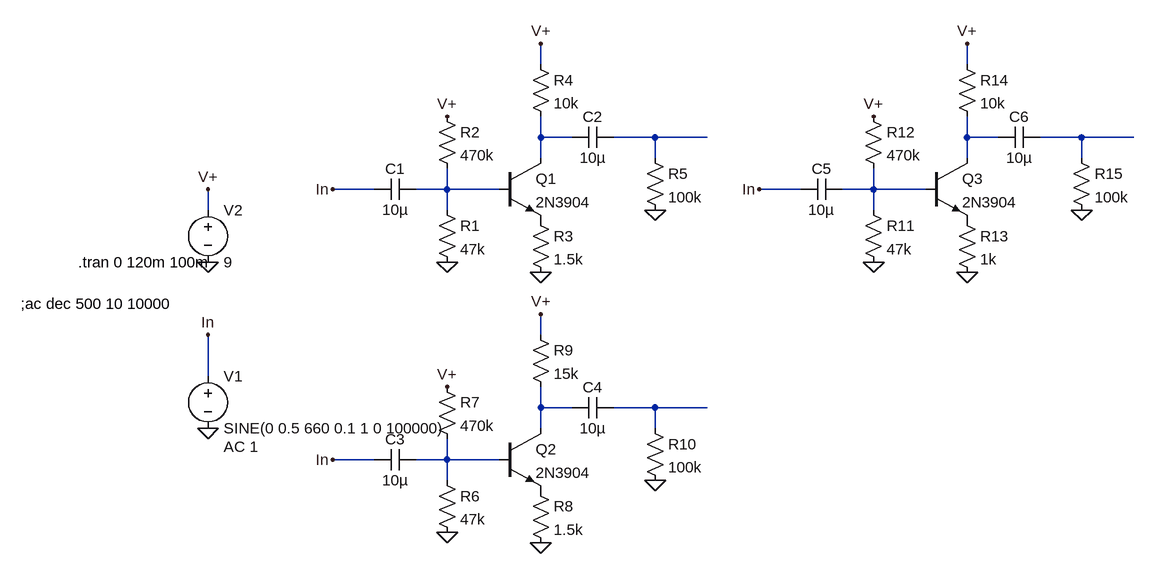
[diagram p0: schematic foxx_tone_machine_last_stage.asc]
foxx_tone_machine_last_stage.asc, the LTspice schematic file:
Version 4
SHEET 1 1492 680
WIRE 576 -304 576 -336
WIRE 1232 -304 1232 -336
WIRE 576 -192 576 -224
WIRE 624 -192 576 -192
WIRE 752 -192 688 -192
WIRE 832 -192 752 -192
WIRE 1232 -192 1232 -224
WIRE 1280 -192 1232 -192
WIRE 1408 -192 1344 -192
WIRE 1488 -192 1408 -192
WIRE 576 -160 576 -192
WIRE 752 -160 752 -192
WIRE 1232 -160 1232 -192
WIRE 1408 -160 1408 -192
WIRE 320 -112 256 -112
WIRE 432 -112 432 -144
WIRE 432 -112 384 -112
WIRE 512 -112 432 -112
WIRE 976 -112 912 -112
WIRE 1088 -112 1088 -144
WIRE 1088 -112 1040 -112
WIRE 1168 -112 1088 -112
WIRE 64 -80 64 -112
WIRE 432 -80 432 -112
WIRE 1088 -80 1088 -112
WIRE 576 112 576 80
WIRE 64 176 64 112
WIRE 576 224 576 192
WIRE 624 224 576 224
WIRE 752 224 688 224
WIRE 832 224 752 224
WIRE 576 256 576 224
WIRE 752 256 752 224
WIRE 320 304 256 304
WIRE 432 304 432 272
WIRE 432 304 384 304
WIRE 512 304 432 304
WIRE 432 336 432 304
FLAG 64 0 0
FLAG 64 256 0
FLAG 432 0 0
FLAG 576 16 0
FLAG 752 -80 0
FLAG 64 -112 V+
FLAG 576 -336 V+
FLAG 64 112 In
FLAG 432 416 0
FLAG 576 432 0
FLAG 752 336 0
FLAG 576 80 V+
FLAG 256 -112 In
FLAG 256 304 In
FLAG 432 -224 V+
FLAG 432 192 V+
FLAG 1088 0 0
FLAG 1232 16 0
FLAG 1408 -80 0
FLAG 1232 -336 V+
FLAG 912 -112 In
FLAG 1088 -224 V+
SYMBOL voltage 64 160 R0
WINDOW 123 24 124 Left 2
WINDOW 39 0 0 Left 2
SYMATTR InstName V1
SYMATTR Value SINE(0 0.5 660 0.1 1 0 100000)
SYMATTR Value2 AC 1
SYMBOL voltage 64 -96 R0
WINDOW 123 0 0 Left 2
WINDOW 39 0 0 Left 2
SYMATTR InstName V2
SYMATTR Value 9
SYMBOL cap 384 -128 R90
WINDOW 0 0 32 VBottom 2
WINDOW 3 32 32 VTop 2
SYMATTR InstName C1
SYMATTR Value 10µ
SYMBOL res 416 -96 R0
SYMATTR InstName R1
SYMATTR Value 47k
SYMBOL res 416 -240 R0
SYMATTR InstName R2
SYMATTR Value 470k
SYMBOL npn 512 -160 R0
SYMATTR InstName Q1
SYMATTR Value 2N3904
SYMBOL res 560 -80 R0
SYMATTR InstName R3
SYMATTR Value 1.5k
SYMBOL res 560 -320 R0
SYMATTR InstName R4
SYMATTR Value 10k
SYMBOL cap 688 -208 R90
WINDOW 0 0 32 VBottom 2
WINDOW 3 32 32 VTop 2
SYMATTR InstName C2
SYMATTR Value 10µ
SYMBOL res 736 -176 R0
SYMATTR InstName R5
SYMATTR Value 100k
SYMBOL cap 384 288 R90
WINDOW 0 0 32 VBottom 2
WINDOW 3 32 32 VTop 2
SYMATTR InstName C3
SYMATTR Value 10µ
SYMBOL res 416 320 R0
SYMATTR InstName R6
SYMATTR Value 47k
SYMBOL res 416 176 R0
SYMATTR InstName R7
SYMATTR Value 470k
SYMBOL npn 512 256 R0
SYMATTR InstName Q2
SYMATTR Value 2N3904
SYMBOL res 560 336 R0
SYMATTR InstName R8
SYMATTR Value 1.5k
SYMBOL res 560 96 R0
SYMATTR InstName R9
SYMATTR Value 15k
SYMBOL cap 688 208 R90
WINDOW 0 0 32 VBottom 2
WINDOW 3 32 32 VTop 2
SYMATTR InstName C4
SYMATTR Value 10µ
SYMBOL res 736 240 R0
SYMATTR InstName R10
SYMATTR Value 100k
SYMBOL cap 1040 -128 R90
WINDOW 0 0 32 VBottom 2
WINDOW 3 32 32 VTop 2
SYMATTR InstName C5
SYMATTR Value 10µ
SYMBOL res 1072 -96 R0
SYMATTR InstName R11
SYMATTR Value 47k
SYMBOL res 1072 -240 R0
SYMATTR InstName R12
SYMATTR Value 470k
SYMBOL npn 1168 -160 R0
SYMATTR InstName Q3
SYMATTR Value 2N3904
SYMBOL res 1216 -80 R0
SYMATTR InstName R13
SYMATTR Value 1k
SYMBOL res 1216 -320 R0
SYMATTR InstName R14
SYMATTR Value 10k
SYMBOL cap 1344 -208 R90
WINDOW 0 0 32 VBottom 2
WINDOW 3 32 32 VTop 2
SYMATTR InstName C6
SYMATTR Value 10µ
SYMBOL res 1392 -176 R0
SYMATTR InstName R15
SYMATTR Value 100k
TEXT -136 0 Left 2 !.tran 0 120m 100m
TEXT -224 64 Left 2 !;ac dec 500 10 10000

The netlist it stands for:
* foxx_tone_machine_last_stage.asc
V1 In 0 SINE(0 0.5 660 0.1 1 0 100000) AC 1
V2 V+ 0 9
C1 N005 In 10µ
R1 N005 0 47k
R2 V+ N005 470k
Q1 N001 N005 P001 0 2N3904
R3 P001 0 1.5k
R4 V+ N001 10k
C2 N002 N001 10µ
R5 N002 0 100k
C3 N009 In 10µ
R6 N009 0 47k
R7 V+ N009 470k
Q2 N007 N009 P002 0 2N3904
R8 P002 0 1.5k
R9 V+ N007 15k
C4 N008 N007 10µ
R10 N008 0 100k
C5 N006 In 10µ
R11 N006 0 47k
R12 V+ N006 470k
Q3 N003 N006 P003 0 2N3904
R13 P003 0 1k
R14 V+ N003 10k
C6 N004 N003 10µ
R15 N004 0 100k
.model NPN NPN
.model PNP PNP
.lib standard.bjt
.tran 0 120m 100m
;ac dec 500 10 10000
.backanno
.end